# EAGLE design Step.2.0 (EAGLE 6.5.0)
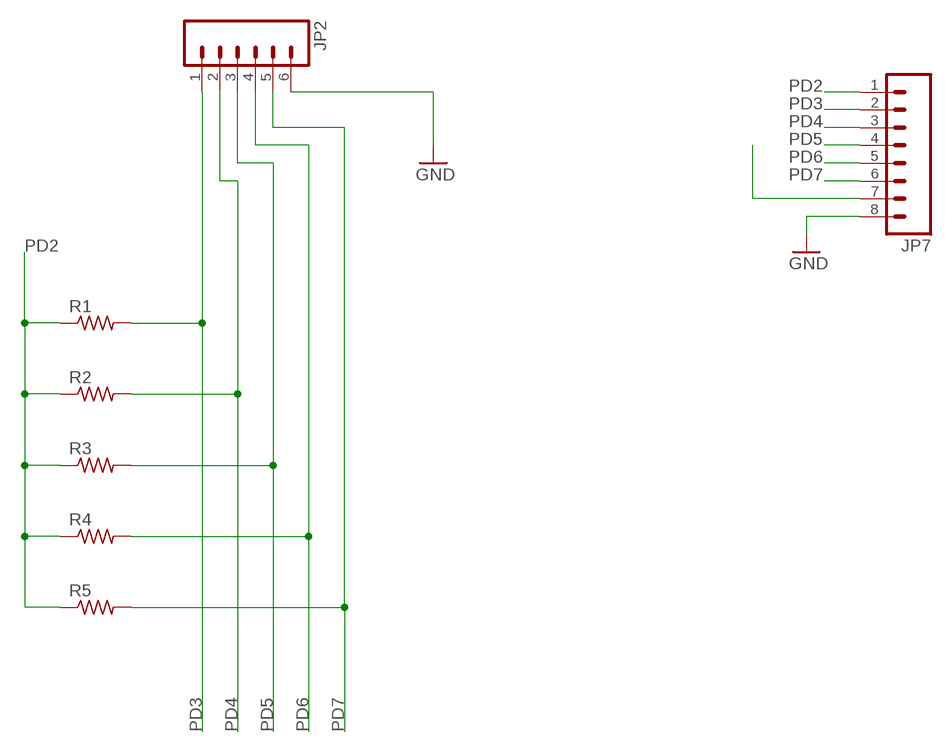
[diagram p0: schematic, sheet 1]

## Parts
JP2  M06SIP  [1X06]
JP7  M08  [1X08]
R1  RESISTOR1206  [1206]
R2  RESISTOR1206  [1206]
R3  RESISTOR1206  [1206]
R4  RESISTOR1206  [1206]
R5  RESISTOR1206  [1206]

## Nets
GND: JP2.6 JP7.8
N$3: JP7.7
PD2: JP7.1 R1.1 R2.1 R3.1 R4.1 R5.1
PD3: JP2.1 JP7.2 R1.2
PD4: JP2.2 JP7.3 R2.2
PD5: JP2.3 JP7.4 R3.2
PD6: JP2.4 JP7.5 R4.2
PD7: JP2.5 JP7.6 R5.2

## Library data of the parts
JP2 = 01_SparkFun:M06: Header 6 Standard 6-pin 0.1" header. Use with straight break away headers (SKU : PRT-00116), right angle break away headers (PRT-00553), swiss pins (PRT-00743), machine pins (PRT-00117), and female headers (PRT-00115). Molex polarized connector foot print use with SKU : PRT-08094 with associated crimp pins and housings. NOTES ON THE VARIANTS LOCK and LOCK_LONGPADS... This footprint was designed to help hold the alignment of a through-hole component (i.e. 6-pin header) while soldering it into place. You may notice that each hole has been shifted either up or down by 0.005 of an inch from it's more standard position (which is a perfectly straight line). This slight alteration caused the pins (the squares in the middle) to touch the edges of the holes. Because they are alternating, it causes a "brace" to hold the component in place. 0.005 has proven to be the perfect amount of "off-center" position when using our standard breakaway headers. Although looks a little odd when you look at the bare footprint, once you have a header in there, the alteration is very hard to notice. Also, if you push a header all the way into place, it is covered up entirely on the bottom side. This idea of altering the position of holes to aid alignment will be further integrated into the Sparkfun Library for other footprints. It can help hold any component with 3 or more connection pins.
JP7 = 01_SparkFun:M08: Header 8 Standard 8-pin 0.1" header. Use with straight break away headers (SKU : PRT-00116), right angle break away headers (PRT-00553), swiss pins (PRT-00743), machine pins (PRT-00117), and female headers (PRT-00115).
R1-R5 = 01_FAB_Hello:RESISTOR

## Board
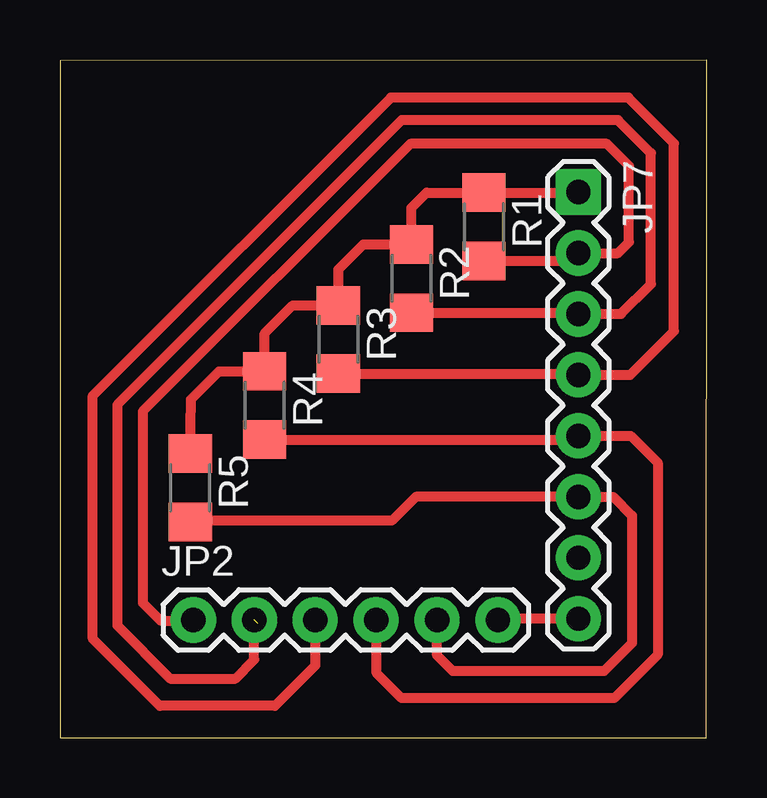
[diagram p1: board, top side]

Size 26.98 x 28.23 mm. Coordinates in mm from the lower left corner, seen from the top.
Outline: 0,0 26.95,0 26.98,28.23 0,28.21 0,0
Copper layers (1*16): Top 0.035mm / dielectric 1.5mm / Bottom 0.035mm
Design rules "default": minimum track width 10mil, minimum drill 24mil, track to track 8mil, track to pad 8mil, pad to pad 8mil, via to via 8mil, smd to smd 8mil, copper to edge 40mil, drill to drill 8mil, minimum pad ring 10mil, minimum via ring 8mil, stop-mask expansion 4mil, vias tented up to drill 0mil, thermal gap 10mil

### Footprints (pad centres in the part's own frame; a part is rotated, then mirrored left to right if it is on the bottom)
1X06 = drill 1.016 pad 1.88: 1 0,0; 2 2.54,0; 3 5.08,0; 4 7.62,0; 5 10.16,0; 6 12.7,0
1X08 = drill 1.016 pad 1.88 square: 1 0,0 | drill 1.016 pad 1.88: 2 2.54,0; 3 5.08,0; 4 7.62,0; 5 10.16,0; 6 12.7,0; 7 15.24,0; 8 17.78,0
1206 = smd 1.6 x 1.803: 1 -1.422,0; 2 1.422,0

### Placement (x,y rotation side)
JP2  5.56,4.9 0 top
JP7  21.62,22.73 270 top
R1  17.68,21.29 270 top
R2  14.66,19.13 270 top
R3  11.61,16.59 270 top
R4  8.53,13.84 270 top
R5  5.44,10.41 270 top

### Tracks (layer width: path | path; a pad name or v marks a point on that pad's centre or on a via)
GND
  Top 0.406: JP7.8 18.31,4.95 JP2.6
PD2
  Top 0.406: R5.1 5.46,14.1 6.63,15.27 R4.1 | R4.1 | R4.1 8.53,16.84 9.7,18.01 R3.1 11.61,19.51 12.65,20.55 R2.1 14.66,22.07 15.29,22.71 R1.1 21.59,22.71 JP7.1
PD3
  Top 0.406: JP2.1 5.54,4.88 4.19,4.88 3.45,5.61 3.45,13.59 14.61,24.74 22.81,24.74 23.72,23.82 23.72,20.65 23.27,20.19 JP7.2 21.29,19.86 R1.2
PD4  (1 unrouted)
  Top 0.406: JP2.2 8.1,3.25 7.32,2.46 4.6,2.46 2.39,4.67 2.39,13.87 14.25,25.73 23.27,25.73 24.64,24.36 24.64,18.9 23.39,17.65 JP7.3 21.56,17.7 R2.2
PD5
  Top 0.406: JP2.3 10.64,3 8.97,1.32 4.17,1.32 1.37,4.12 1.37,14.25 13.79,26.67 23.7,26.67 25.6,24.77 25.6,16.94 23.77,15.11 JP7.4 21.56,15.16 R3.2
PD6
  Top 0.406: JP2.4 13.21,4.88 13.21,2.69 14.25,1.65 23.11,1.65 24.92,3.45 24.92,11.46 23.8,12.57 JP7.5 21.46,12.42 R4.2
PD7
  Top 0.406: JP2.5 15.72,3.43 16.38,2.77 22.68,2.77 23.85,3.94 23.85,9.25 23.06,10.03 JP7.6 14.83,10.03 13.84,9.04 5.49,9.04 R5.2